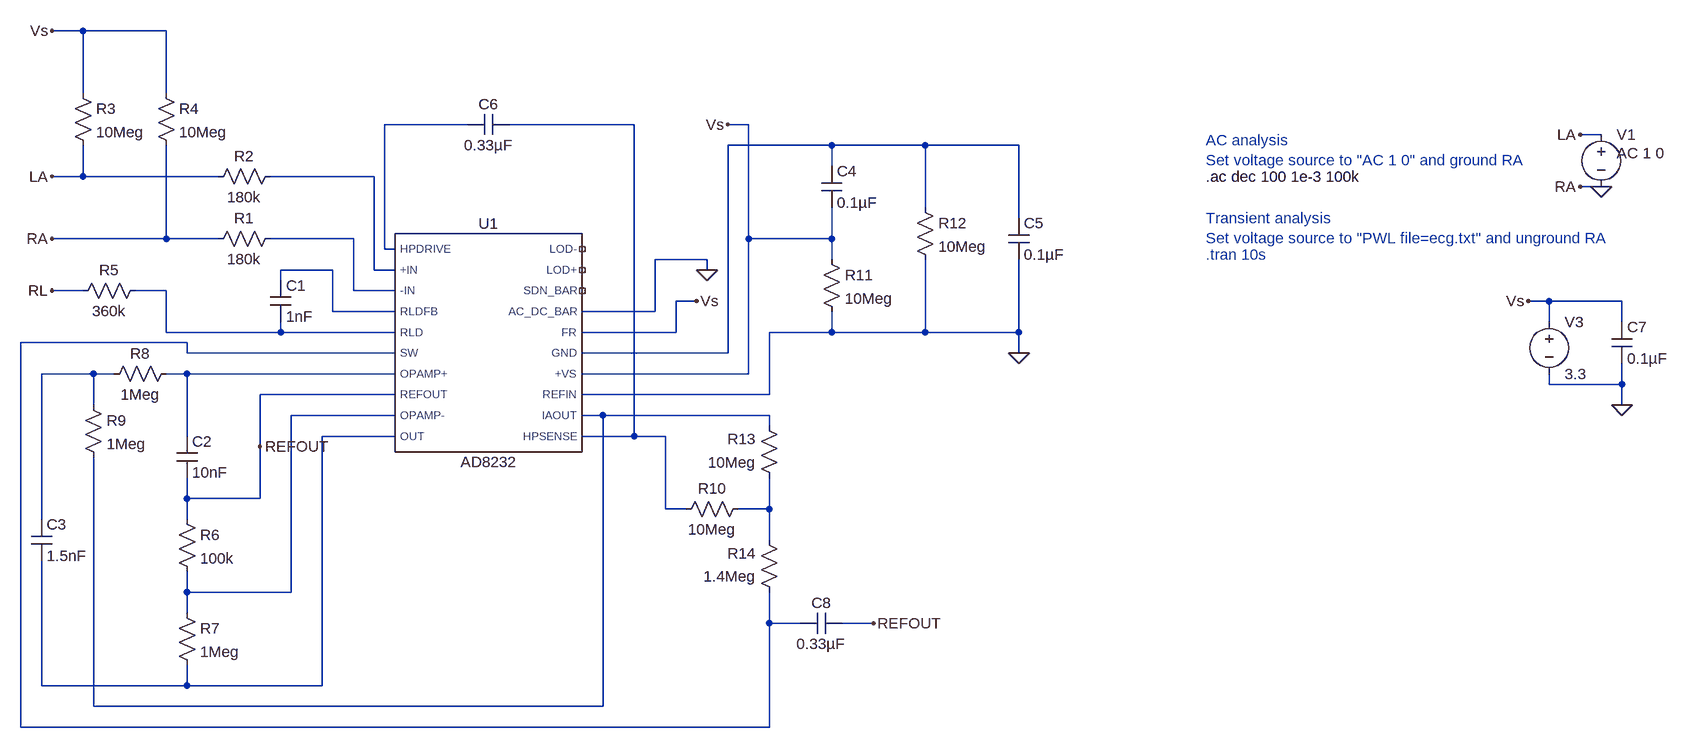
[diagram p0: schematic ecg_monitor.asc]
ecg_monitor.asc, the LTspice schematic file:
Version 4
SHEET 1 2156 924
WIRE -400 -352 -448 -352
WIRE -272 -352 -400 -352
WIRE -400 -256 -400 -352
WIRE -272 -256 -272 -352
WIRE 192 -208 64 -208
WIRE 448 -208 256 -208
WIRE 624 -208 592 -208
WIRE 1936 -192 1904 -192
WIRE 752 -176 592 -176
WIRE 896 -176 752 -176
WIRE 1040 -176 896 -176
WIRE 752 -144 752 -176
WIRE -400 -128 -400 -176
WIRE -400 -128 -448 -128
WIRE -192 -128 -400 -128
WIRE 48 -128 -112 -128
WIRE 1936 -112 1904 -112
WIRE 896 -80 896 -176
WIRE 1040 -64 1040 -176
WIRE -272 -32 -272 -176
WIRE -272 -32 -448 -32
WIRE -192 -32 -272 -32
WIRE 16 -32 -112 -32
WIRE 624 -32 624 -208
WIRE 752 -32 752 -80
WIRE 752 -32 624 -32
WIRE 64 -16 64 -208
WIRE 80 -16 64 -16
WIRE 560 0 480 0
WIRE 752 0 752 -32
WIRE -16 16 -96 16
WIRE 48 16 48 -128
WIRE 80 16 48 16
WIRE 560 16 560 0
WIRE -96 32 -96 16
WIRE -400 48 -448 48
WIRE -272 48 -320 48
WIRE 16 48 16 -32
WIRE 80 48 16 48
WIRE 544 64 512 64
WIRE 1856 64 1824 64
WIRE 1968 64 1856 64
WIRE -16 80 -16 16
WIRE 80 80 -16 80
WIRE 480 80 480 0
WIRE 480 80 368 80
WIRE 1856 96 1856 64
WIRE 1968 96 1968 64
WIRE -272 112 -272 48
WIRE -96 112 -96 96
WIRE -96 112 -272 112
WIRE 80 112 -96 112
WIRE 512 112 512 64
WIRE 512 112 368 112
WIRE 752 112 752 80
WIRE 752 112 656 112
WIRE 896 112 896 0
WIRE 896 112 752 112
WIRE 1040 112 1040 0
WIRE 1040 112 896 112
WIRE -240 128 -496 128
WIRE -240 144 -240 128
WIRE 80 144 -240 144
WIRE 592 144 592 -176
WIRE 592 144 368 144
WIRE 1040 144 1040 112
WIRE -384 176 -464 176
WIRE -352 176 -384 176
WIRE -240 176 -272 176
WIRE 80 176 -240 176
WIRE 624 176 624 -32
WIRE 624 176 368 176
WIRE 1856 192 1856 176
WIRE 1968 192 1968 160
WIRE 1968 192 1856 192
WIRE 80 208 -128 208
WIRE 656 208 656 112
WIRE 656 208 368 208
WIRE -384 224 -384 176
WIRE 1968 224 1968 192
WIRE 80 240 -80 240
WIRE 400 240 368 240
WIRE 656 240 400 240
WIRE 656 256 656 240
WIRE -240 272 -240 176
WIRE 80 272 -32 272
WIRE 448 272 448 -208
WIRE 448 272 368 272
WIRE 496 272 448 272
WIRE -128 288 -128 208
WIRE -240 368 -240 336
WIRE -128 368 -128 288
WIRE -128 368 -240 368
WIRE 496 384 496 272
WIRE 528 384 496 384
WIRE 656 384 656 336
WIRE 656 384 608 384
WIRE -464 400 -464 176
WIRE -240 400 -240 368
WIRE 656 432 656 384
WIRE -240 512 -240 480
WIRE -80 512 -80 240
WIRE -80 512 -240 512
WIRE -240 544 -240 512
WIRE 656 560 656 512
WIRE 704 560 656 560
WIRE 816 560 768 560
WIRE -464 656 -464 464
WIRE -240 656 -240 624
WIRE -240 656 -464 656
WIRE -32 656 -32 272
WIRE -32 656 -240 656
WIRE -384 688 -384 304
WIRE 400 688 400 240
WIRE 400 688 -384 688
WIRE -496 720 -496 128
WIRE 656 720 656 560
WIRE 656 720 -496 720
FLAG 1904 -192 LA
FLAG 1904 -112 RA
FLAG -448 -352 Vs
FLAG -448 -128 LA
FLAG -448 -32 RA
FLAG 544 64 Vs
FLAG 560 16 0
FLAG 1040 144 0
FLAG 1824 64 Vs
FLAG 1968 224 0
FLAG 592 -208 Vs
FLAG -448 48 RL
FLAG 816 560 REFOUT
FLAG -128 288 REFOUT
FLAG 1936 -112 0
SYMBOL AD8232 224 128 R0
SYMATTR InstName U1
SYMBOL voltage 1936 -208 R0
WINDOW 123 24 44 Left 2
WINDOW 39 0 0 Left 0
WINDOW 3 24 44 Left 2
SYMATTR Value2 AC 1 0
SYMATTR Value ""
SYMATTR InstName V1
SYMBOL res -96 -48 R90
WINDOW 0 0 56 VBottom 2
WINDOW 3 32 56 VTop 2
SYMATTR InstName R1
SYMATTR Value 180k
SYMBOL res -96 -144 R90
WINDOW 0 0 56 VBottom 2
WINDOW 3 32 56 VTop 2
SYMATTR InstName R2
SYMATTR Value 180k
SYMBOL res -416 -272 R0
SYMATTR InstName R3
SYMATTR Value 10Meg
SYMBOL res -288 -272 R0
SYMATTR InstName R4
SYMATTR Value 10Meg
SYMBOL cap -112 32 R0
SYMATTR InstName C1
SYMATTR Value 1nF
SYMBOL res -304 32 R90
WINDOW 0 0 56 VBottom 2
WINDOW 3 32 56 VTop 2
SYMATTR InstName R5
SYMATTR Value 360k
SYMBOL res 736 -16 R0
SYMATTR InstName R11
SYMATTR Value 10Meg
SYMBOL cap 736 -144 R0
SYMATTR InstName C4
SYMATTR Value 0.1µF
SYMBOL res 880 -96 R0
SYMATTR InstName R12
SYMATTR Value 10Meg
SYMBOL cap 1024 -64 R0
SYMATTR InstName C5
SYMATTR Value 0.1µF
SYMBOL voltage 1856 80 R0
SYMATTR InstName V3
SYMATTR Value 3.3
SYMBOL cap 1952 96 R0
SYMATTR InstName C7
SYMATTR Value 0.1µF
SYMBOL cap -256 272 R0
SYMATTR InstName C2
SYMATTR Value 10nF
SYMBOL res -256 384 R0
SYMATTR InstName R6
SYMATTR Value 100k
SYMBOL res -256 528 R0
SYMATTR InstName R7
SYMATTR Value 1Meg
SYMBOL res -256 160 R90
WINDOW 0 0 56 VBottom 2
WINDOW 3 32 56 VTop 2
SYMATTR InstName R8
SYMATTR Value 1Meg
SYMBOL res -400 208 R0
SYMATTR InstName R9
SYMATTR Value 1Meg
SYMBOL cap -480 400 R0
SYMATTR InstName C3
SYMATTR Value 1.5nF
SYMBOL cap 256 -224 R90
WINDOW 0 0 32 VBottom 2
WINDOW 3 32 32 VTop 2
SYMATTR InstName C6
SYMATTR Value 0.33µF
SYMBOL res 624 368 R90
WINDOW 0 0 56 VBottom 2
WINDOW 3 32 56 VTop 2
SYMATTR InstName R10
SYMATTR Value 10Meg
SYMBOL res 672 352 R180
WINDOW 0 36 76 Left 2
WINDOW 3 36 40 Left 2
SYMATTR InstName R13
SYMATTR Value 10Meg
SYMBOL res 672 528 R180
WINDOW 0 36 76 Left 2
WINDOW 3 36 40 Left 2
SYMATTR InstName R14
SYMATTR Value 1.4Meg
SYMBOL cap 768 544 R90
WINDOW 0 0 32 VBottom 2
WINDOW 3 32 32 VTop 2
SYMATTR InstName C8
SYMATTR Value 0.33µF
TEXT 1328 -64 Left 2 ;Transient analysis\nSet voltage source to "PWL file=ecg.txt" and unground RA
TEXT 1328 -8 Left 2 ;.tran 10s
TEXT 1328 -128 Left 2 !.ac dec 100 1e-3 100k
TEXT 1328 -184 Left 2 ;AC analysis\nSet voltage source to "AC 1 0" and ground RA

The netlist it stands for:
* ecg_monitor.asc
XU1 N001 N004 N005 N006 N007 N008 N010 REFOUT N011 N013 NC_01 NC_02 NC_03 0 Vs N003 Vs 0 N012 N002 AD8232  ; pins HPDRIVE +IN -IN RLDFB RLD SW OPAMP+ REFOUT OPAMP- OUT LOD- LOD+ SDN_BAR AC_DC_BAR FR GND +VS REFIN IAOUT HPSENSE
V1 LA 0 AC 1 0
R1 N005 0 180k
R2 N004 LA 180k
R3 Vs LA 10Meg
R4 Vs 0 10Meg
C1 N006 N007 1nF
R5 N007 RL 360k
R11 Vs 0 10Meg
C4 N003 Vs 0.1µF
R12 N003 0 10Meg
C5 N003 0 0.1µF
V3 Vs 0 3.3
C7 Vs 0 0.1µF
C2 N010 REFOUT 10nF
R6 REFOUT N011 100k
R7 N011 N013 1Meg
R8 N010 N009 1Meg
R9 N009 N012 1Meg
C3 N009 N013 1.5nF
C6 N002 N001 0.33µF
R10 N014 N002 10Meg
R13 N014 N012 10Meg
R14 N008 N014 1.4Meg
C8 REFOUT N008 0.33µF
* Transient analysis
* Set voltage source to "PWL file=ecg.txt" and unground RA
* .tran 10s
.ac dec 100 1e-3 100k
* AC analysis
* Set voltage source to "AC 1 0" and ground RA
.lib AD8232.cir
.backanno
.end